# Altium schematic sheet SCH Uno-Balancer.SchDoc: Arduino BMS - Passive Balancer
size Letter; Organization: Adv Power Electronics Lab; Address1: Kettering University; Address2: 1700 University Ave; Address3: Flint, MI 48504; Address4: United States of America; DocumentNumber: 1; SheetNumber: 1; SheetTotal: 2
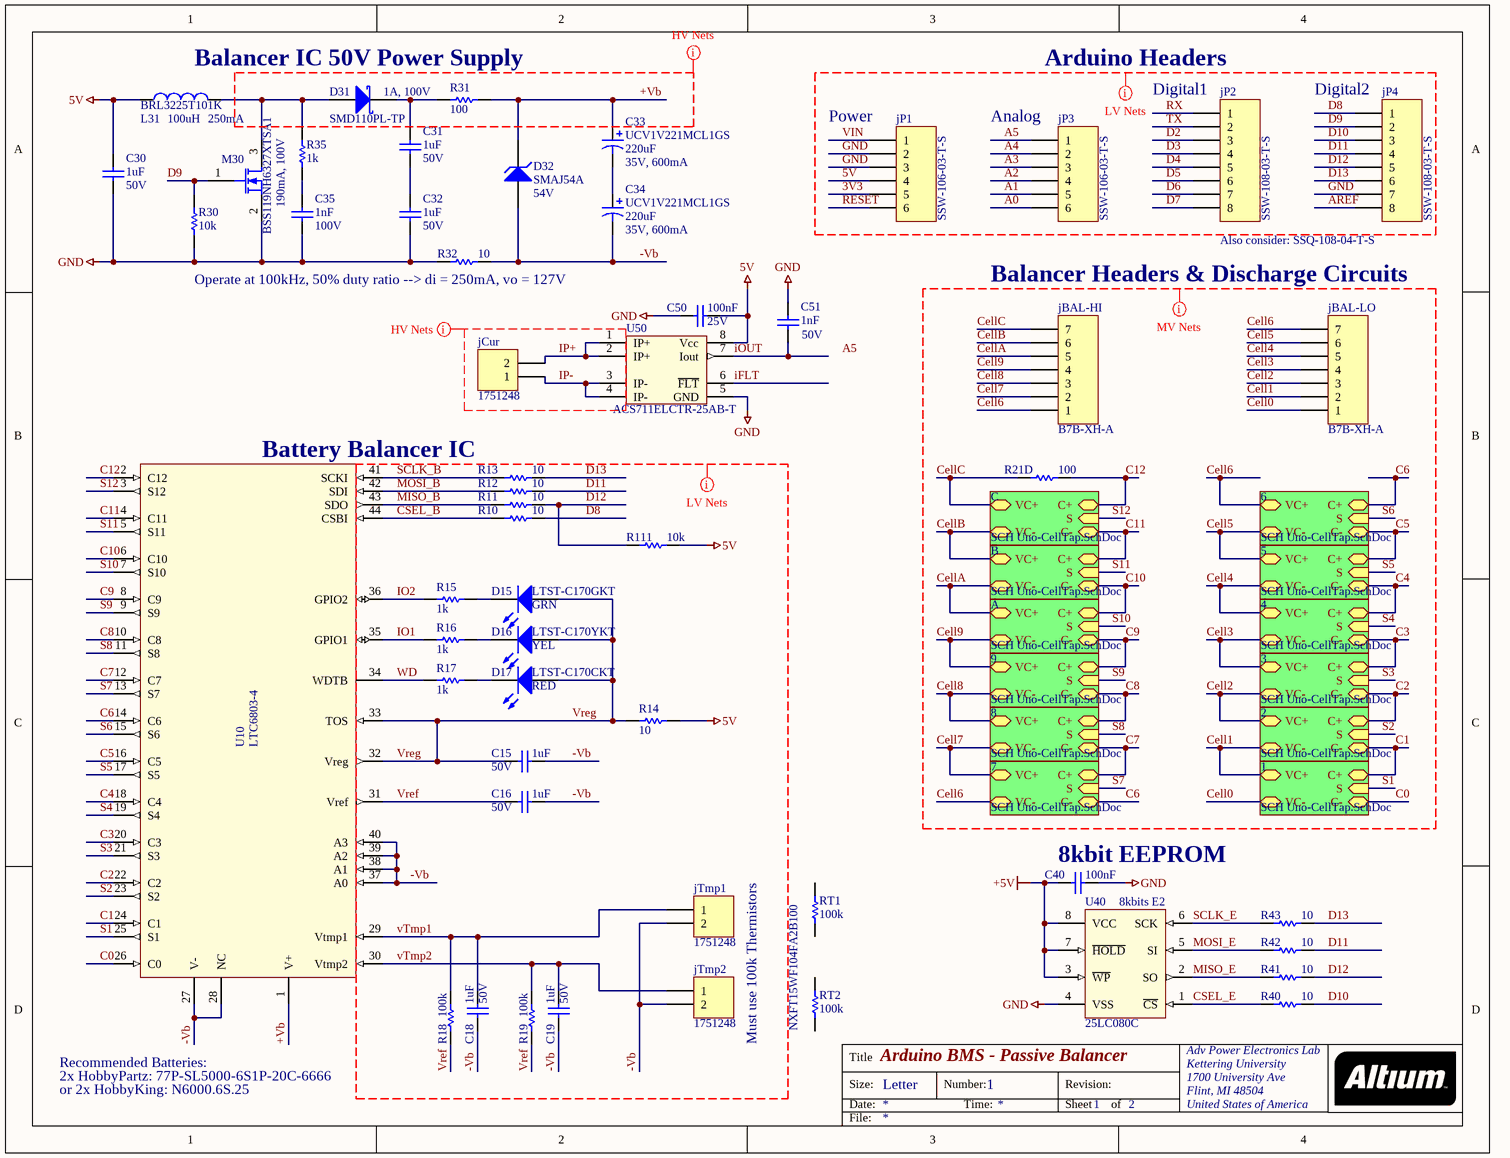
[diagram p0: SCH Uno-Balancer.SchDoc]

## Parts
C15  value 1uF  Rated: 50V  [CAPC2012N]  (hidden comment: CL21F105ZBFNNNE)
C16  value 1uF  Rated: 50V  [CAPC2012N]  (hidden comment: CL21F105ZBFNNNE)
C18  value 1uF  Rated: 50V  [CAPC2012N]  (hidden comment: CL21F105ZBFNNNE)
C19  value 1uF  Rated: 50V  [CAPC2012N]  (hidden comment: CL21F105ZBFNNNE)
C30  value 1uF  Rated: 50V  [CAPC2012N]  (hidden comment: CL21F105ZBFNNNE)
C31  value 1uF  Rated: 50V  [CAPC2012N]  (hidden comment: CL21F105ZBFNNNE)
C32  value 1uF  Rated: 50V  [CAPC2012N]  (hidden comment: CL21F105ZBFNNNE)
C33  UCV1V221MCL1GS  value 220uF  Rated: 35V, 600mA  [CAP SMT 6.3x8mm]
C34  UCV1V221MCL1GS  value 220uF  Rated: 35V, 600mA  [CAP SMT 6.3x8mm]
C35  value 1nF  Rated: 100V  [CAPC2012N]  (hidden comment: C0805C102K1RACTU)
C40  value 100nF  [CAPC2012N]  (hidden comment: C0805C104Z5VACTU)
C50  value 100nF  Rated: 25V  [CAPC2012N]  (hidden comment: C0805C104M3RACTU)
C51  value 1nF  Rated: 50V  [CAPC2012N]  (hidden comment: C0805C102K5RACTU)
D15  LTST-C170GKT  value GRN  [DIO2012N-G]
D16  LTST-C170YKT  value YEL  [DIO2012N-Y]
D17  LTST-C170CKT  value RED  [DIO2012N-R]
D31  SMD110PL-TP  Rated: 1A, 100V  [SOD123]
D32  SMAJ54A  value 54V  [DO214-SMA]
jBAL-HI  B7B-XH-A  [JST-XH-B7]
jBAL-LO  B7B-XH-A  [JST-XH-B7]
jCur  1751248  [TERM2x3.5mm]
jP1  SSW-106-03-T-S  [HDR1X6]
jP2  SSW-108-03-T-S  [HDR1X8]
jP3  SSW-106-03-T-S  [HDR1X6]
jP4  SSW-108-03-T-S  [HDR1X8]
jTmp1  1751248  [TERM2x3.5mm]
jTmp2  1751248  [TERM2x3.5mm]
L31  BRL3225T101K  value 100uH  Rated: 250mA  [INDC3225N]
M30  BSS119NH6327XTSA1  Rated: 190mA, 100V  [SOT23-3N]
R10  value 10  [RESC2012N]  (hidden comment: ERJ-6ENF10R0V)
R11  value 10  [RESC2012N]  (hidden comment: ERJ-6ENF10R0V)
R12  value 10  [RESC2012N]  (hidden comment: ERJ-6ENF10R0V)
R13  value 10  [RESC2012N]  (hidden comment: ERJ-6ENF10R0V)
R14  value 10  [RESC2012N]  (hidden comment: ERJ-6ENF10R0V)
R15  value 1k  [RESC2012N]  (hidden comment: ERJ-6ENF1001V)
R16  value 1k  [RESC2012N]  (hidden comment: ERJ-6ENF1001V)
R17  value 1k  [RESC2012N]  (hidden comment: ERJ-6ENF1001V)
R18  value 100k  [RESC2012N]  (hidden comment: ERJ-6ENF1003V)
R19  value 100k  [RESC2012N]  (hidden comment: ERJ-6ENF1003V)
R21D  value 100  [RESC2012N]  (hidden comment: ERJ-6ENF1000V)
R30  value 10k  [RESC2012N]  (hidden comment: ERJ-6ENF1002V)
R31  value 100  [RESC2012N]  (hidden comment: ERJ-6ENF1000V)
R32  value 10  [RESC2012N]  (hidden comment: ERJ-6ENF10R0V)
R35  value 1k  [RESC2012N]  (hidden comment: ERJ-6ENF1001V)
R40  value 10  [RESC2012N]  (hidden comment: ERJ-6ENF10R0V)
R41  value 10  [RESC2012N]  (hidden comment: ERJ-6ENF10R0V)
R42  value 10  [RESC2012N]  (hidden comment: ERJ-6ENF10R0V)
R43  value 10  [RESC2012N]  (hidden comment: ERJ-6ENF10R0V)
R111  value 10k  [RESC2012N]  (hidden comment: ERJ-6ENF1002V)
RT1  value 100k  (hidden comment: NXFT15WF104FA2B100)
RT2  value 100k  (hidden comment: NXFT15WF104FA2B100)
U10  LTC6803-4  [SSOP44]
U40  25LC080C  value 8kbits E2  [SOIC-8-150]
U50  ACS711ELCTR-25AB-T  [SOIC-8-150]

## Sub-sheets
1 = SCH Uno-CellTap.SchDoc: C+ (bidir), C- (bidir), VC- (bidir), VC+ (bidir), S (in)
2 = SCH Uno-CellTap.SchDoc: C+ (bidir), C- (bidir), VC- (bidir), VC+ (bidir), S (in)
3 = SCH Uno-CellTap.SchDoc: C+ (bidir), C- (bidir), VC- (bidir), VC+ (bidir), S (in)
4 = SCH Uno-CellTap.SchDoc: C+ (bidir), C- (bidir), VC- (bidir), VC+ (bidir), S (in)
5 = SCH Uno-CellTap.SchDoc: C+ (bidir), C- (bidir), VC- (bidir), VC+ (bidir), S (in)
6 = SCH Uno-CellTap.SchDoc: C+ (bidir), C- (bidir), VC- (bidir), VC+ (bidir), S (in)
7 = SCH Uno-CellTap.SchDoc: C+ (bidir), C- (bidir), VC- (bidir), VC+ (bidir), S (in)
8 = SCH Uno-CellTap.SchDoc: C+ (bidir), C- (bidir), VC- (bidir), VC+ (bidir), S (in)
9 = SCH Uno-CellTap.SchDoc: C+ (bidir), C- (bidir), VC- (bidir), VC+ (bidir), S (in)
A = SCH Uno-CellTap.SchDoc: C+ (bidir), C- (bidir), VC- (bidir), VC+ (bidir), S (in)
B = SCH Uno-CellTap.SchDoc: C+ (bidir), C- (bidir), VC- (bidir), VC+ (bidir), S (in)
C = SCH Uno-CellTap.SchDoc: C+ (bidir), C- (bidir), VC- (bidir), VC+ (bidir), S (in)

## Nets
5V: C30.1 C50.1 jP1.4 L31.1 R14.2 R111.2 U50.8(Vcc)
+5V: C40.2 U40.3(~{WP}) U40.7(~{HOLD}) U40.8(VCC)
GND: C30.2 C32.2 C35.2 C40.1 C50.2 C51.1 jP1.2 jP1.3 jP4.7 M30.2(S) R30.2 R32.1 U40.4(VSS) U50.5(GND)
3V3: jP1.5
+Vb: C33.1 D32.2(K) R31.2 U10.1(V+)
-Vb: C15.1 C16.1 C18.1 C19.1 C34.2 D32.1(A) jTmp1.2 jTmp2.2 R32.2 U10.27(V-) U10.28(NC) U10.37(A0) U10.38(A1) U10.39(A2) U10.40(A3)
A0: jP3.6
A1: jP3.5
A2: jP3.4
A3: jP3.3
A4: jP3.2
A5: jP3.1
AREF: jP4.8
C0: U10.26(C0) ; sheet 1/C-
C1: U10.24(C1) ; sheet 1/C+, sheet 2/C-
C2: U10.22(C2) ; sheet 2/C+, sheet 3/C-
C3: U10.20(C3) ; sheet 3/C+, sheet 4/C-
C4: U10.18(C4) ; sheet 4/C+, sheet 5/C-
C5: U10.16(C5) ; sheet 5/C+, sheet 6/C-
C6: U10.14(C6) ; sheet 6/C+, sheet 7/C-
C7: U10.12(C7) ; sheet 7/C+, sheet 8/C-
C8: U10.10(C8) ; sheet 8/C+, sheet 9/C-
C9: U10.8(C9) ; sheet 9/C+, sheet A/C-
C10: U10.6(C10) ; sheet A/C+, sheet B/C-
C11: U10.4(C11) ; sheet B/C+, sheet C/C-
C12: R21D.2 U10.2(C12) ; sheet C/C+
Cell0: jBAL-LO.1 ; sheet 1/VC-
Cell1: jBAL-LO.2 ; sheet 1/VC+, sheet 2/VC-
Cell2: jBAL-LO.3 ; sheet 2/VC+, sheet 3/VC-
Cell3: jBAL-LO.4 ; sheet 3/VC+, sheet 4/VC-
Cell4: jBAL-LO.5 ; sheet 4/VC+, sheet 5/VC-
Cell5: jBAL-LO.6 ; sheet 5/VC+, sheet 6/VC-
Cell6: jBAL-HI.1 jBAL-LO.7 ; sheet 6/VC+, sheet 7/VC-
Cell7: jBAL-HI.2 ; sheet 7/VC+, sheet 8/VC-
Cell8: jBAL-HI.3 ; sheet 8/VC+, sheet 9/VC-
Cell9: jBAL-HI.4 ; sheet 9/VC+, sheet A/VC-
CellA: jBAL-HI.5 ; sheet A/VC+, sheet B/VC-
CellB: jBAL-HI.6 ; sheet B/VC+, sheet C/VC-
CellC: jBAL-HI.7 R21D.1 ; sheet C/VC+
CSEL_B: R10.1 U10.44(CSBI)
CSEL_E: R40.1 U40.1(~{CS})
D2: jP2.3
D3: jP2.4
D4: jP2.5
D5: jP2.6
D6: jP2.7
D7: jP2.8
D8: jP4.1 R10.2
D9: jP4.2 M30.1(G) R30.1
D10: jP4.3 R40.2
D11: jP4.4 R12.2 R42.2
D12: jP4.5 R11.2 R41.2 R111.1
D13: jP4.6 R13.2 R43.2
iFLT: U50.6(~{FLT})
IO1: R16.2 U10.35(GPIO1)
IO2: R15.2 U10.36(GPIO2)
iOUT: C51.2 U50.7(Iout)
IP+: jCur.2 U50.1(IP+) U50.2(IP+)
IP-: jCur.1 U50.3(IP-) U50.4(IP-)
MISO_B: R11.1 U10.43(SDO)
MISO_E: R41.1 U40.2(SO)
MOSI_B: R12.1 U10.42(SDI)
MOSI_E: R42.1 U40.5(SI)
RESET: jP1.6
RX: jP2.1
S1: U10.25(S1) ; sheet 1/S
S2: U10.23(S2) ; sheet 2/S
S3: U10.21(S3) ; sheet 3/S
S4: U10.19(S4) ; sheet 4/S
S5: U10.17(S5) ; sheet 5/S
S6: U10.15(S6) ; sheet 6/S
S7: U10.13(S7) ; sheet 7/S
S8: U10.11(S8) ; sheet 8/S
S9: U10.9(S9) ; sheet 9/S
S10: U10.7(S10) ; sheet A/S
S11: U10.5(S11) ; sheet B/S
S12: U10.3(S12) ; sheet C/S
SCLK_B: R13.1 U10.41(SCKI)
SCLK_E: R43.1 U40.6(SCK)
TX: jP2.2
VIN: jP1.1
Vref: C16.2 R18.1 R19.1 U10.31(Vref)
Vreg: C15.2 D15.1(A) D16.1(A) D17.1(A) R14.1 U10.32(Vreg) U10.33(TOS)
vTmp1: C18.2 jTmp1.1 R18.2 U10.29(Vtmp1)
vTmp2: C19.2 jTmp2.1 R19.2 U10.30(Vtmp2)
WD: R17.2 U10.34(WDTB)
NetC31_1: C31.1 D31.2(K) R31.1
NetC31_2: C31.2 C32.1
NetC33_2: C33.2 C34.1
NetC35_1: C35.1 R35.2
NetD15_2: D15.2(K) R15.1
NetD16_2: D16.2(K) R16.1
NetD17_2: D17.2(K) R17.1
NetD31_1: D31.1(A) L31.2 M30.3(D) R35.1

Not connected (* = marked no-connect by the designer): RT1 1 2; RT2 1 2

## Layout directives
net class MV Nets: C0, C1, C2, C3, C4, C5, C6, C7, C8, C9, C10, C11, C12, Cell0, Cell1, Cell2, Cell3, Cell4, Cell5, Cell6, Cell7, Cell8, Cell9, CellA, CellB, CellC, S1, S2, S3, S4, S5, S6, S7, S8, S9, S10, S11, S12
net class LV Nets: 3V3, 5V, -Vb, A0, A1, A2, A3, A4, A5, AREF, CSEL_B, D2, D3, D4, D5, D6, D7, D8, D9, D10, D11, D12, D13, GND, IO1, IO2, MISO_B, MOSI_B, RESET, RX, SCLK_B, TX, VIN, Vref, Vreg, vTmp1, vTmp2, WD
net class HV Nets: +Vb, IP+, IP-

## Notes on the sheet
- Balancer IC 50V Power Supply
- (near jP2) Arduino Headers
- (near jP2) Digital1
- (near jP4) Digital2
- (near jP1) Power
- (near jP3) Analog
- (near R32) Operate at 100kHz, 50% duty ratio --> di = 250mA, vo = 127V
- Balancer Headers & Discharge Circuits
- Also consider: SSQ-108-04-T-S
- Battery Balancer IC
- (near C40) 8kbit EEPROM
- Must use 100k Thermistors
- NXFT15WF104FA2B100
- Recommended Batteries:
- 2x HobbyPartz: 77P-SL5000-6S1P-20C-6666
- or 2x HobbyKing: N6000.6S.25
- Labels drawn without touching a wire or pin: A5
- Title
- Size:
- Date:
- Letter
- Number:
- Time:
- Revision:
- Sheet
- of
- File:

## Library data of the parts
C15 C16 C18 C19 C30-C32 = Cap: Capacitor; Tol: 20%; Temp: 85C; Supplier 1: Digi-Key; Supplier Part Number 1: 1276-3010-1-ND; Category: C
C33 C34 = Cap Pol1: Aluminum Electrolytic Capacitor; Tol: 20%; Temp: 105C; Category: C; Supplier 1: Digi-Key; Supplier Part Number 1: 493-14355-1-ND
C35 = Cap: Capacitor; Tol: 10%; Temp: 125C; Category: C; Supplier 1: Digi-Key; Supplier Part Number 1: 399-1148-1-ND
C40 = Cap: Capacitor; Rated: 50V; Tol: 20%; Temp: 85C; Supplier 1: Digi-Key; Supplier Part Number 1: 399-1177-1-ND; Category: C
C50 = Cap: Capacitor; Tol: 20%; Temp: 125C; Supplier 1: Digi-Key; Supplier Part Number 1: 399-8000-1-ND; Category: C
C51 = Cap: Capacitor; Tol: 10%; Temp: 85C; Supplier 1: Digi-Key; Supplier Part Number 1: 399-1147-1-ND; Category: C
D15 = LTST-C170GKT: SMT Green Si LED; Rated: 10mA, 6mcd; Supplier 1: Digi-Key; Supplier Part Number 1: 160-1179-1-ND; Category: D
D16 = LTST-C170YKT: SMT Yellow Si LED; Rated: 10mA, 6mcd; Category: D; Supplier 1: Digi-Key; Supplier Part Number 1: 160-1175-1-ND
D17 = LTST-C170CKT: SMT Red Si LED; Rated: 10mA, 10mcd; Supplier 1: Digi-Key; Supplier Part Number 1: 160-1176-1-ND; Category: D
D31 = SMD110PL-TP: Silicon Schottky Diode, 1A, 100V; Temp: 125C; Value: 850mV @ 1A; Category: D; Supplier 1: Digi-Key; Supplier Part Number 1: SMD110PL-TPMSCT-ND
D32 = D Zener: Zener Diode; Rated: 400W; Supplier 1: Digi-Key; Supplier Part Number 1: SMAJ54ALFCT-ND; Category: D
jBAL-HI jBAL-LO = JST B7B-XH-A: JST Battery Balance Port Header, 7-Pin; Supplier 1: Digi-Key; Supplier Part Number 1: 455-2252-ND; Category: J; ComponentLink1Description: &Datasheet; ComponentLink1URL: http://www.jst-mfg.com/product/pdf/eng/eXH.pdf
jCur jTmp1 jTmp2 = Header 2: Header Conn Term Block, 2-Pin, 3.5mm Pitch; Rated: 10A; Value: 16-30 AWG; Supplier 1: Digi-Key; Supplier Part Number 1: 277-5719-ND; Category: J; ComponentLink1Description: &Datasheet; ComponentLink1URL: http://media.digikey.com/PDF/Data%20Sheets/Phoenix%20Contact%20PDFs/1751248.pdf
jP1 jP3 = Header 6: Header, 6-Pin; Category: J; Supplier 1: Digi-Key; Supplier Part Number 1: SAM8865-ND
jP2 jP4 = Header 8: Header, 8-Pin; Category: J; Supplier 1: Digi-Key; Supplier Part Number 1: SAM8866-ND
L31 = BLM21P221SN: Ferrite Bead Inductor; Category: L; Supplier 1: Digi-Key; Supplier Part Number 1: 587-2170-1-ND
M30 = BSS123: Low-Power N-Channel MOSFET, 100V 170mA; Value: 6 Ohm; Category: M; Supplier 1: Digi-Key; Supplier Part Number 1: BSS119NH6327XTSA1CT-ND
R10-R19 R21D R30-R32 R35 R40-R43 R111 = Res1: Resistor; Rated: 1/8W; Tol: 1%; Supplier 1: Digi-Key; Category: R
  R10-R14 R32 R40-R43: Supplier Part Number 1: P10.0CCT-ND
  R15-R17 R30 R35 R111: Supplier Part Number 1: P1.00KCCT-ND
  R18 R19: Supplier Part Number 1: P100KCCT-ND
  R21D R31: Supplier Part Number 1: P100CCT-ND
RT1 RT2 = Res1: NTC Thermistor Resistor; Rated: 100mW; Tol: 1%; Category: R; Supplier 1: Digi-Key; Supplier Part Number 1: 490-5633-ND
U10 = LTC6803-4: Multicell Battery Stack Monitor; Supplier 1: Digi-Key; Supplier Part Number 1: LTC6803HG-4#PBF-ND; Category: U; ComponentLink1Description: &Datasheet; ComponentLink1URL: http://cds.linear.com/docs/en/datasheet/680324fa.pdf
U40 = 25LC080C: EEPROM 8kbit SPI Serial Interface; Rated: >1M Cycles; Supplier 1: Digi-Key; Supplier Part Number 1: 25LC080C-I/SN-ND; ComponentLink1Description: &Datasheet; ComponentLink1URL: http://ww1.microchip.com/downloads/en/DeviceDoc/22151b.pdf; Category: U
U50 = ACS711: Internal Hall-Effect Current Transducer; Rated: 25A; Supplier 1: Digi-Key; Supplier Part Number 1: 620-1371-1-ND; Category: U; ComponentLink1Description: &Mfg Site; ComponentLink1URL: http://www.allegromicro.com/en/Products/Current-Sensor-ICs/Zero-To-Fifty-Amp-Integrated-Conductor-Sensor-ICs/ACS711.aspx